# EAGLE schematic fb_in_8_24V (EAGLE 4.16)
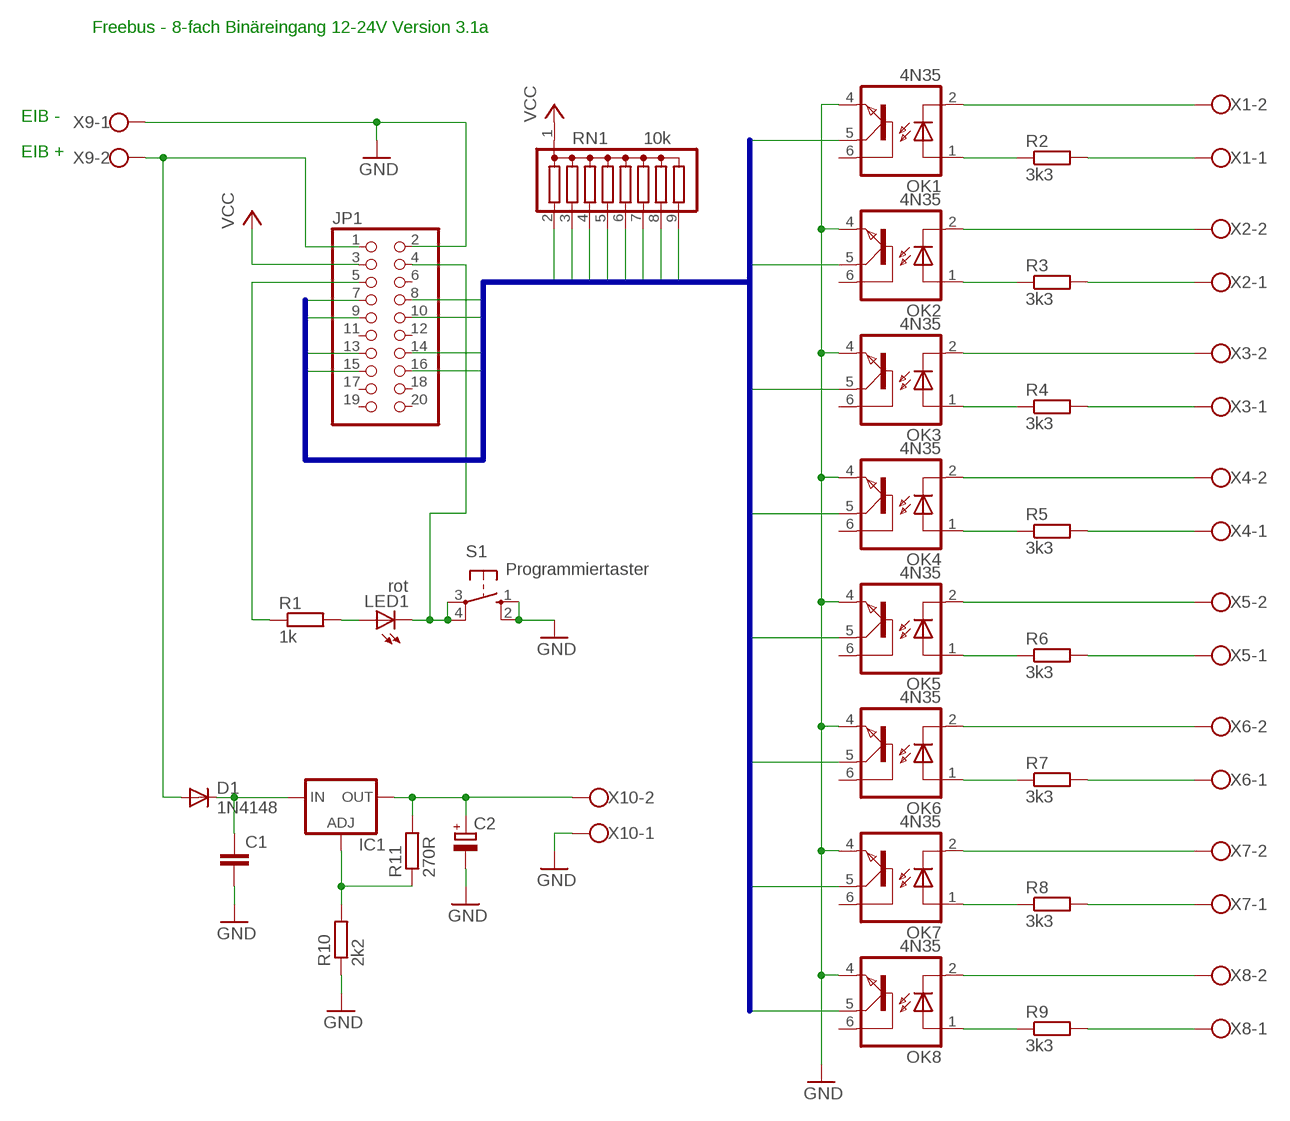
[diagram p0: schematic, sheet 1]

## Parts
C1  C-EU050-024X044  [C050-024X044]
C2  CPOL-EUE2.5-7  [E2,5-7]
D1  1N4148  [DO35-10]
IC1  LM317L  [317L]
JP1  PINHD-2X10  [2X10]
LED1  rot  LED3MM  [LED3MM]
OK1  4N35  [DIL06]
OK2  4N35  [DIL06]
OK3  4N35  [DIL06]
OK4  4N35  [DIL06]
OK5  4N35  [DIL06]
OK6  4N35  [DIL06]
OK7  4N35  [DIL06]
OK8  4N35  [DIL06]
R1  1k  R-EU_0207/10  [0207/10]
R2  3k3  R-EU_0207/10  [0207/10]
R3  3k3  R-EU_0207/10  [0207/10]
R4  3k3  R-EU_0207/10  [0207/10]
R5  3k3  R-EU_0207/10  [0207/10]
R6  3k3  R-EU_0207/10  [0207/10]
R7  3k3  R-EU_0207/10  [0207/10]
R8  3k3  R-EU_0207/10  [0207/10]
R9  3k3  R-EU_0207/10  [0207/10]
R10  2k2  R-EU_0207/10  [0207/10]
R11  270R  R-EU_0207/10  [0207/10]
RN1  10k  G08R  [SIL9]
S1  Programmiertaster  10-XX  [B3F-10XX]
X1  W237-102  [W237-102]
X2  W237-102  [W237-102]
X3  W237-102  [W237-102]
X4  W237-102  [W237-102]
X5  W237-102  [W237-102]
X6  W237-102  [W237-102]
X7  W237-102  [W237-102]
X8  W237-102  [W237-102]
X9  W237-102  [W237-102]
X10  W237-102  [W237-102]

## Nets
GND: C1.2 C2.- JP1.2 OK1.4(EMI) OK2.4(EMI) OK3.4(EMI) OK4.4(EMI) OK5.4(EMI) OK6.4(EMI) OK7.4(EMI) OK8.4(EMI) R10.1 S1.1(S) S1.2(S1) X9.1 X10.1
IO1: JP1.7 OK1.5(COL) RN1.2
IO2: JP1.8 OK2.5(COL) RN1.3
IO3: JP1.9 OK3.5(COL) RN1.4
IO4: JP1.10 OK4.5(COL) RN1.5
IO5: JP1.13 OK5.5(COL) RN1.6
IO6: JP1.14 OK6.5(COL) RN1.7
IO7: JP1.15 OK7.5(COL) RN1.8
IO8: JP1.16 OK8.5(COL) RN1.9
N$1: R8.2 X7.1
N$2: JP1.4 LED1.K(C) S1.3(P) S1.4(P1)
N$3: LED1.A R1.2
N$4: JP1.5 R1.1
N$5: D1.A JP1.1 X9.2
N$7: C2.+ IC1.2(OUT) R11.2 X10.2
N$8: IC1.1(ADJ) R10.2 R11.1
N$9: C1.1 D1.C IC1.3(IN)
N$25: OK2.2(C) X2.2
N$26: OK1.1(A) R2.1
N$27: OK2.1(A) R3.1
N$28: OK3.1(A) R4.1
N$29: OK4.1(A) R5.1
N$30: OK5.1(A) R6.1
N$31: OK6.1(A) R7.1
N$32: OK7.1(A) R8.1
N$33: OK8.1(A) R9.1
N$34: R3.2 X2.1
N$35: OK3.2(C) X3.2
N$36: R4.2 X3.1
N$37: OK4.2(C) X4.2
N$38: R5.2 X4.1
N$39: OK5.2(C) X5.2
N$40: R6.2 X5.1
N$41: OK1.2(C) X1.2
N$42: OK6.2(C) X6.2
N$43: R7.2 X6.1
N$44: OK7.2(C) X7.2
N$46: OK8.2(C) X8.2
N$47: R9.2 X8.1
N$48: R2.2 X1.1
VCC: JP1.3 RN1.1
Unconnected: JP1.6 JP1.11 JP1.12 JP1.17 JP1.18 JP1.19 JP1.20 OK1.6(BAS) OK2.6(BAS) OK3.6(BAS) OK4.6(BAS) OK5.6(BAS) OK6.6(BAS) OK7.6(BAS) OK8.6(BAS)

## Buses
IO[1..8]

## Notes on the sheet
- Freebus - 8-fach Binäreingang 12-24V Version 3.1a
- EIB -
- EIB +

## Library data of the parts
C1 = rcl:C-EU: CAPACITOR, European symbol
C2 = rcl:CPOL-EU: POLARIZED CAPACITOR, European symbol
D1 = diode:1N4148: DIODE high speed (Philips)
IC1 = v-reg:LM317L: VOLTAGE REGULATOR
JP1 = pinhead:PINHD-2X10: PIN HEADER
LED1 = led:LED: LED OSRAM: - CHIPLED LG R971, LG N971, LY N971, LG Q971, LY Q971, LO R971, LY R971 LH N974, LH R974 LS Q976, LO Q976, LY Q976 LO Q996 - Hyper CHIPLED LW Q18S LB Q993, LB Q99A, LB R99A - SideLED LS A670, LO A670, LY A670, LG A670, LP A670 LB A673, LV A673, LT A673, LW A673 LH A674 LY A675 LS A676, LA A676, LO A676, LY A676, LW A676 LS A679, LY A679, LG A679 - Hyper Micro SIDELED® LS Y876, LA Y876, LO Y876, LY Y876 LT Y87S - SmartLED LW L88C, LW L88S LB L89C, LB L89S, LG L890 LS L89K, LO L89K, LY L89K LS L896, LA L896, LO L896, LY L896 - TOPLED LS T670, LO T670, LY T670, LG T670, LP T670 LSG T670, LSP T670, LSY T670, LOP T670, LYG T670 LG T671, LOG T671, LSG T671 LB T673, LV T673, LT T673, LW T673 LH T674 LS T676, LA T676, LO T676, LY T676, LB T676, LH T676, LSB T676, LW T676 LB T67C, LV T67C, LT T67C, LS T67K, LO T67K, LY T67K, LW E67C LS E67B, LA E67B, LO E67B, LY E67B, LB E67C, LV E67C, LT E67C LW T67C LS T679, LY T679, LG T679 LS T770, LO T770, LY T770, LG T770, LP T770 LB T773, LV T773, LT T773, LW T773 LH T774 LS E675, LA E675, LY E675, LS T675 LS T776, LA T776, LO T776, LY T776, LB T776 LHGB T686 LT T68C, LB T68C - Hyper Mini TOPLED® LB M676 - Mini TOPLED Santana® LG M470 LS M47K, LO M47K, LY M47K Source: http://www.osram.convergy.de - LUMILED® LXK2-PW12-R00, LXK2-PW12-S00, LXK2-PW14-U00, LXK2-PW14-V00 LXK2-PM12-R00, LXK2-PM12-S00, LXK2-PM14-U00 LXK2-PE12-Q00, LXK2-PE12-R00, LXK2-PE12-S00, LXK2-PE14-T00, LXK2-PE14-U00 LXK2-PB12-K00, LXK2-PB12-L00, LXK2-PB12-M00, LXK2-PB14-N00, LXK2-PB14-P00, LXK2-PB14-Q00 LXK2-PR12-L00, LXK2-PR12-M00, LXK2-PR14-Q00, LXK2-PR14-R00 LXK2-PD12-Q00, LXK2-PD12-R00, LXK2-PD12-S00 LXK2-PH12-R00, LXK2-PH12-S00 LXK2-PL12-P00, LXK2-PL12-Q00, LXK2-PL12-R00 Source: www.luxeon.com
OK1-OK8 = optocoupler:4N35: MOTOROLA OPTO COUPLER
R1-R11 = rcl:R-EU_: RESISTOR, European symbol
RN1 = resistor-sil:G08R: SIL RESISTOR
S1 = switch-omron:10-XX: OMRON SWITCH
X1-X10 = con-wago-500:W237-102: WAGO SCREW CLAMP